# EAGLE schematic main (EAGLE 8.0.2)

## Sheet 1 of 2
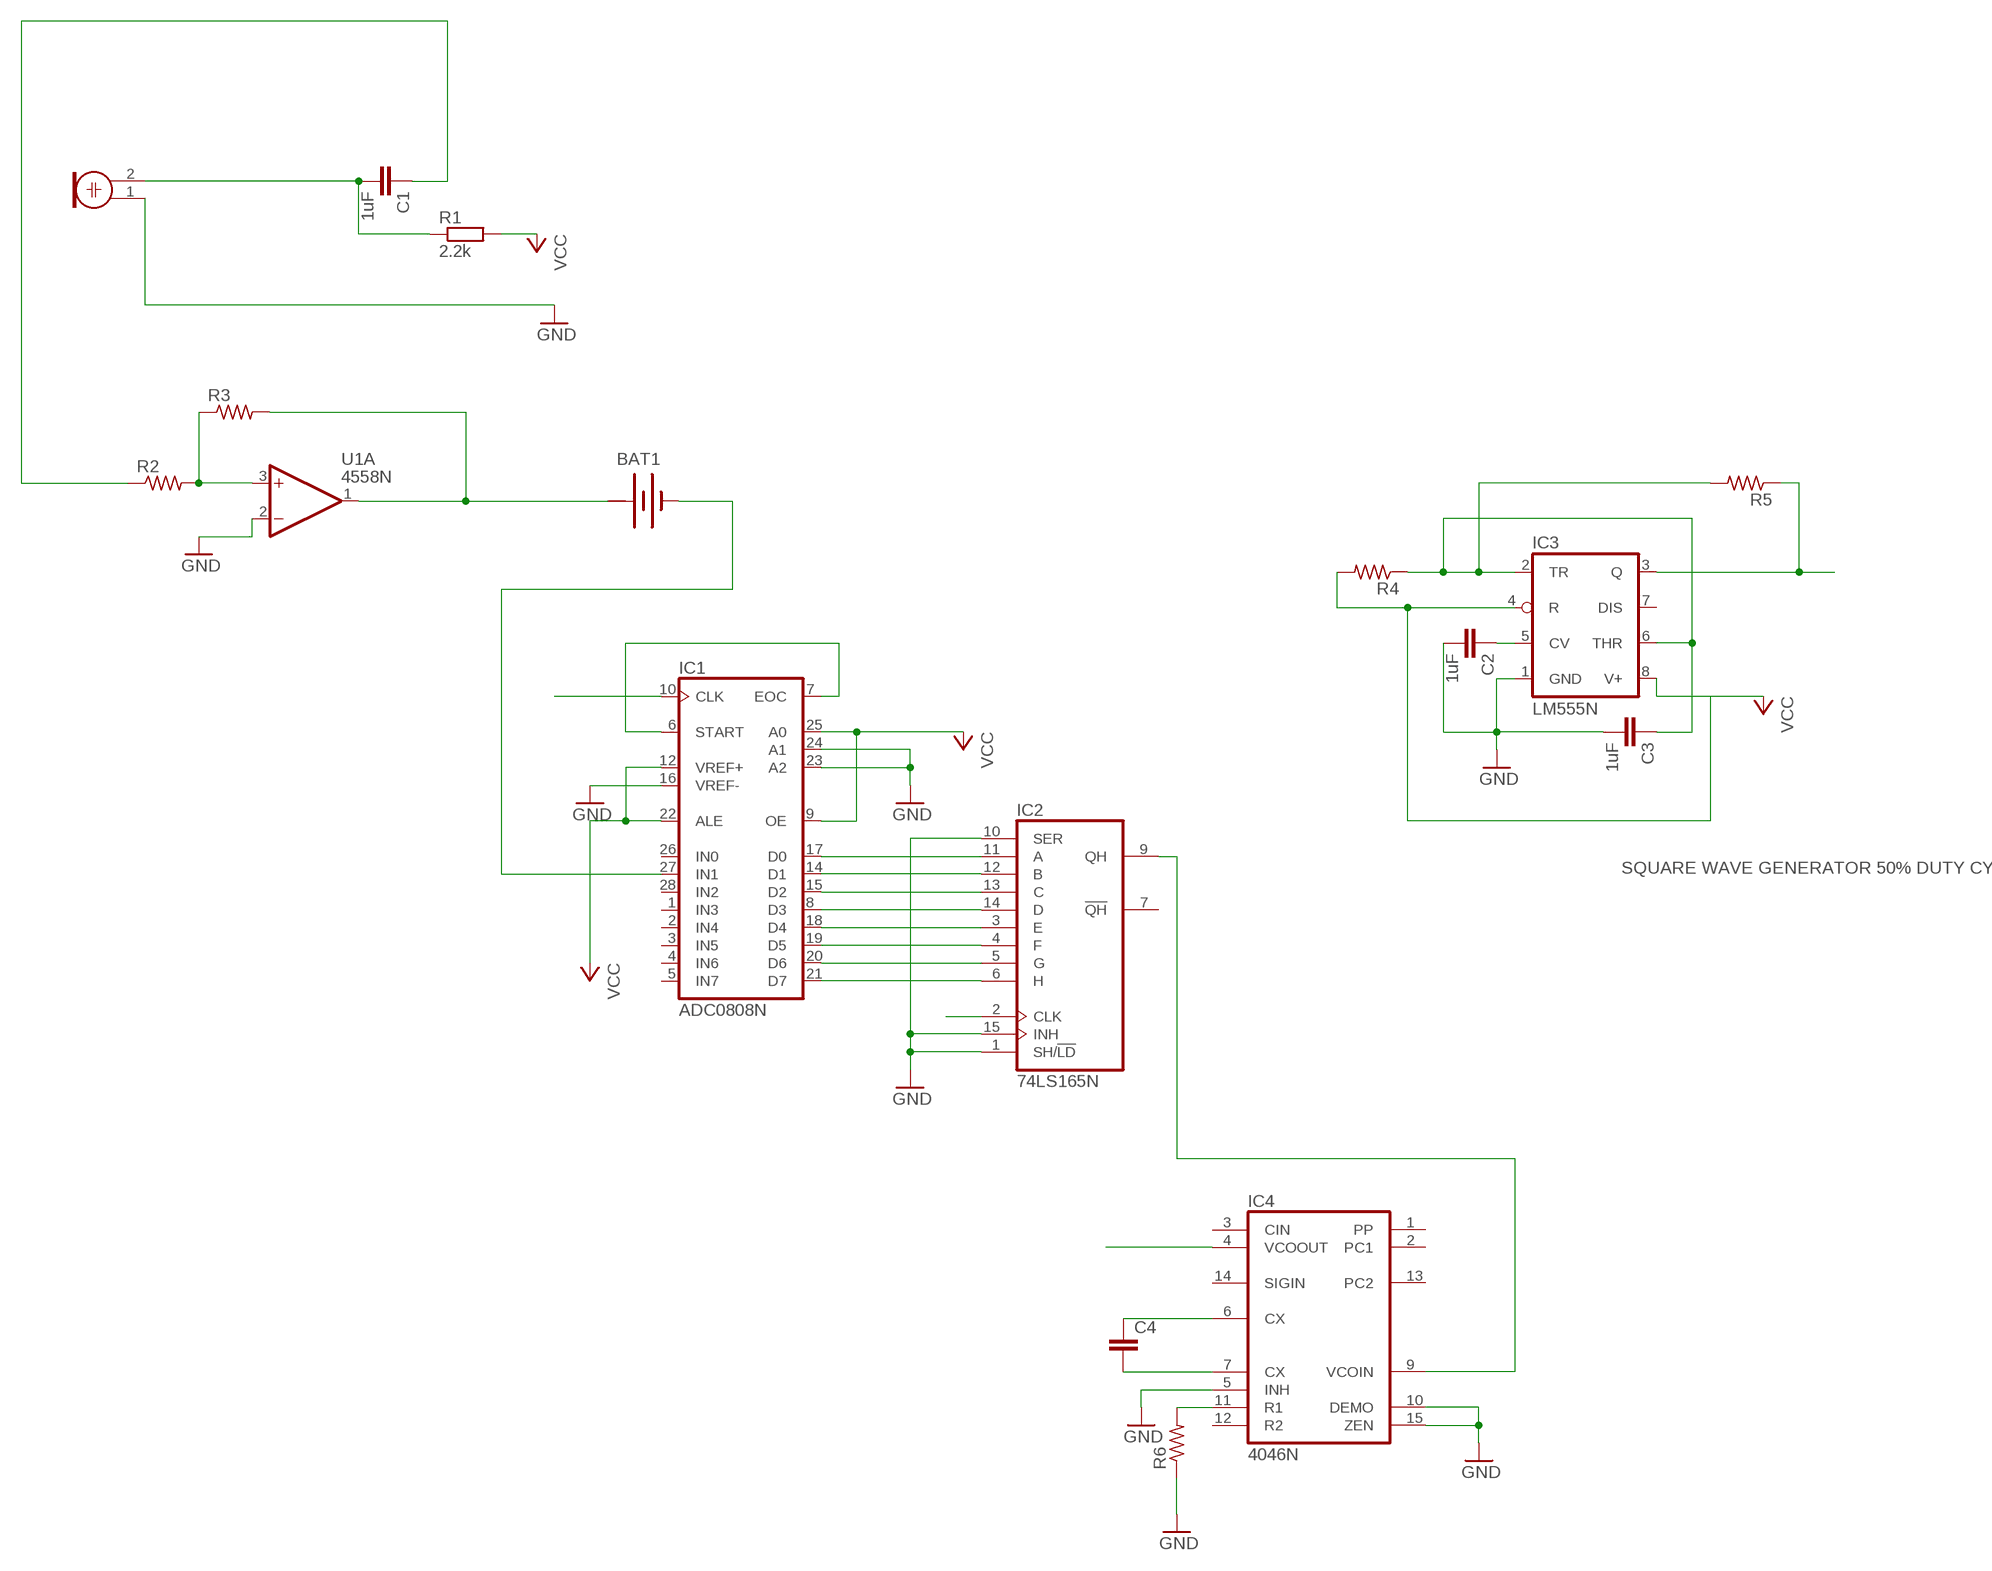
[diagram p0: schematic, sheet 1]

### Parts
BAT1  BATTERY  [BATTERY]
C1  1uF  C2,5-3  [C2.5-3]
C2  1uF  C2,5-3  [C2.5-3]
C3  1uF  C2,5-3  [C2.5-3]
C4  C2.5/2  [C2.5-2]
IC1  ADC0808N  [DIL28-6]
IC2  74LS165N  [DIL16]
IC3  LM555N  [DIL08-ROUND]
IC4  4046N  [DIL16]
M1  ELECTRET_MICROPHON-F6050AP  [F6050AP]
R1  2.2k  R-EU_0204/7  [0204/7]
R2  R-US_0204/7  [0204/7]
R3  R-US_0204/7  [0204/7]
R4  R-US_0204/7  [0204/7]
R5  R-US_0204/7  [0204/7]
R6  R-US_0204/7  [0204/7]
U1  4558N  [DIL08]

### Nets
CLK: IC1.10(CLK) IC2.2(CLK) IC3.3(Q) R5.1
GND: C2.2 C3.2 IC1.16(VREF-) IC1.23(A2) IC1.24(A1) IC2.1(SH/!LD) IC2.10(SER) IC2.15(INH) IC3.1(GND) IC4.5(INH) IC4.10(DEMO) IC4.15(ZEN) M1.1 R6.1 U1.2(A:-IN)
N$1: C1.2 M1.2 R1.1
N$2: C1.1 R2.1
N$3: R2.2 R3.1 U1.3(A:+IN)
N$4: BAT1.+ R3.2 U1.1(A:OUT)
N$5: BAT1.- IC1.27(IN1)
N$6: IC1.6(START) IC1.7(EOC)
N$7: IC1.17(D0) IC2.11(A)
N$8: IC1.14(D1) IC2.12(B)
N$9: IC1.15(D2) IC2.13(C)
N$10: IC1.8(D3) IC2.14(D)
N$11: IC1.18(D4) IC2.3(E)
N$12: IC1.19(D5) IC2.4(F)
N$13: IC1.20(D6) IC2.5(G)
N$14: IC1.21(D7) IC2.6(H)
N$15: IC2.9(QH) IC4.9(VCOIN)
N$16: C2.1 IC3.5(CV)
N$17: C4.1 IC4.6(CX)
N$18: C3.1 IC3.2(TR) IC3.6(THR) R4.1 R5.2
N$19: C4.2 IC4.7(CX)
N$20: IC4.11(R1) R6.2
N$21: IC4.4(VCOOUT)
VCC: IC1.9(OE) IC1.12(VREF+) IC1.22(ALE) IC1.25(A0) IC3.4(R) IC3.8(V+) R1.2 R4.2
Unconnected: IC1.1(IN3) IC1.2(IN4) IC1.3(IN5) IC1.4(IN6) IC1.5(IN7) IC1.26(IN0) IC1.28(IN2) IC2.7(!QH) IC3.7(DIS) IC4.1(PP) IC4.2(PC1) IC4.3(CIN) IC4.12(R2) IC4.13(PC2) IC4.14(SIGIN) U1.5(B:+IN) U1.6(B:-IN) U1.7(B:OUT)

### Notes on the sheet
- SQUARE WAVE GENERATOR 50% DUTY CYCLE

## Sheet 2 of 2

## Power pins joined to a net without a drawn wire
+: BAT1.+@1(+)
GND: IC1.13(GND) IC2.8(GND)
VCC: IC1.11(VCC) IC2.16(VCC)
VCC+: U1.8(P:VCC+)
VCC-: U1.4(P:VCC-)
VDD: IC4.16(VDD)
VSS: IC4.8(VSS)

## Library data of the parts
BAT1 = special:BATTERY: BATTERY
C1-C4 = capacitor-wima:C: CAPACITOR naming: grid - package width
IC1 = linear:ADC0808: 8-bit A/D CONVERTER with 8-channel multiplexer
IC2 = 74xx-eu:74*165: 8-bit parallel load SHIFT REGISTER
IC3 = adafruit:*555: TIMER Changed DIP package to have round (not oval) pin pads http://www.ladyada.net/library/pcb/eaglelibrary.html
IC4 = 40xx:4046: Micropower PLL
M1 = microphon:ELECTRET_MICROPHON-: Electret Condenser Microphone
R1 = resistor:R-EU_: RESISTOR, European symbol
R2-R6 = adafruit:R-US_: RESISTOR, American symbol
U1 = op-amp:4558: OP-AMP - Dual